# Altium schematic sheet JTAG.SchDoc
size A3; SheetNumber: 12; SheetTotal: 13
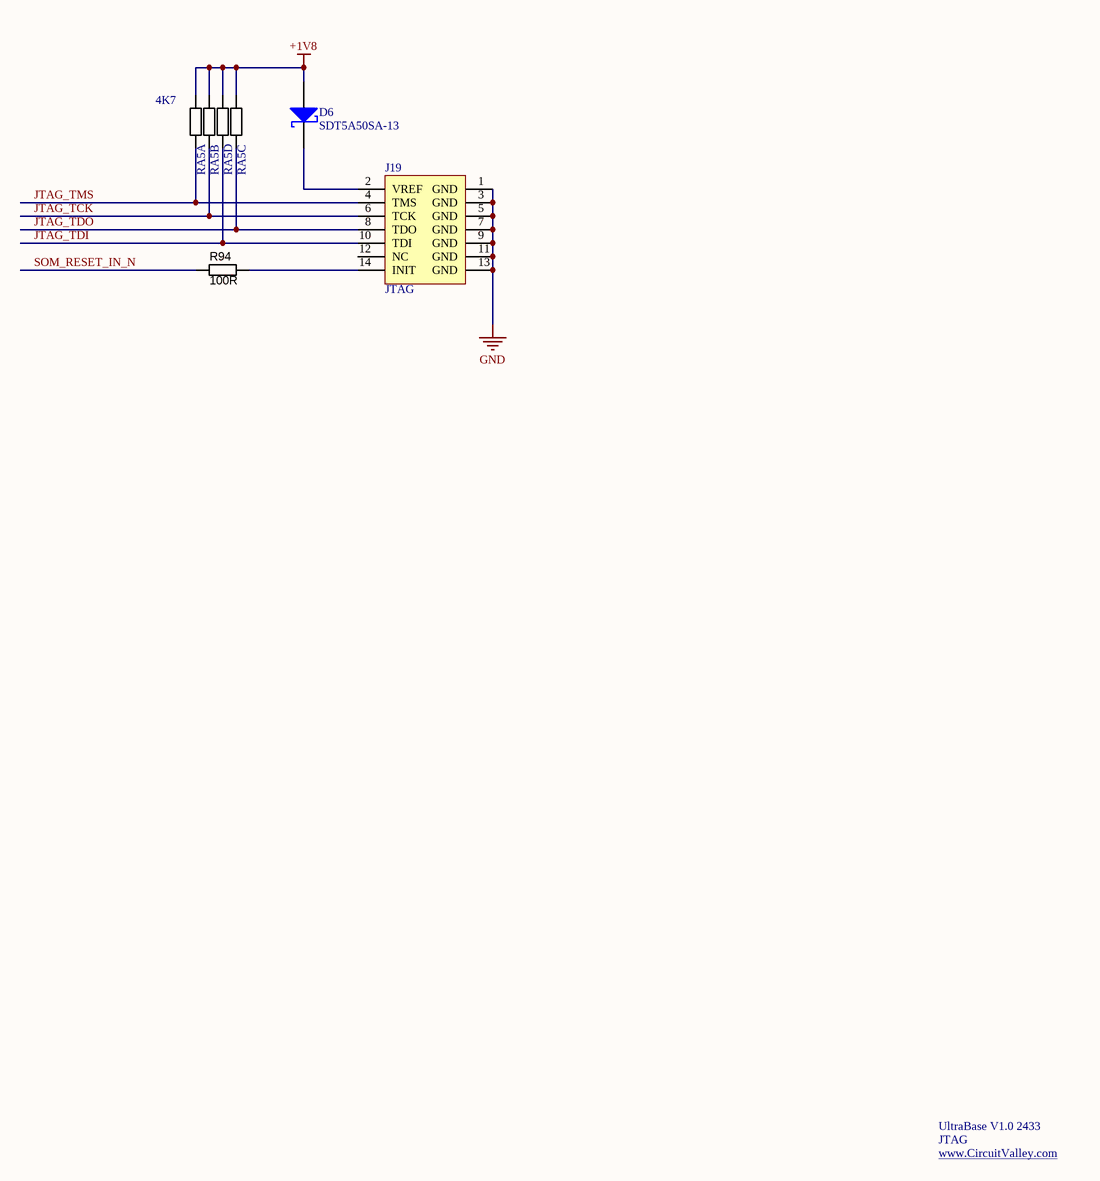
[diagram p0: JTAG.SchDoc]

## Parts
D6  SDT5A50SA-13  [DO-214AC]
J19  JTAG  [878321420]
R94  value 100R  [RESC1608N]  (hidden comment: RES_NL_0603)
RA5  Thick Film  [YC164]  (value not drawn)  (parts A,B,C,D of 4)

## Nets
+1V8: D6.1(A) RA5.5 RA5.6 RA5.7 RA5.8
GND: J19.1(GND) J19.3(GND) J19.5(GND) J19.7(GND) J19.9(GND) J19.11(GND) J19.13(GND)
JTAG_TCK: J19.6(TCK) RA5.2
JTAG_TDI: J19.10(TDI) RA5.4
JTAG_TDO: J19.8(TDO) RA5.3
JTAG_TMS: J19.4(TMS) RA5.1
SOM_RESET_IN_N: R94.2
NetD6_2: D6.2(K) J19.2(VREF)
NetJ19_14: J19.14(INIT) R94.1

Not connected (* = marked no-connect by the designer): J19 12(NC)

## Notes on the sheet
- (near RA5) 4K7
- UltraBase V1.0 2433
- JTAG
- www.CircuitValley.com <http://www.CircuitValley.com>

## Library data of the parts
D6 = Diode
J19 = Xilinx_JTAG
R94 = RES_NL_0603: Resistor, SMD chip; Manufacturer 1: Royal Ohm; Ratings: 1/10 W; Tolerance: ±5%; Package / Case: 0603 (1608 metric)
RA5 = RES_ARRAY_0402_5%: Resistor array 4-pack 5% 0402 SMD